# Altium schematic sheet MAGI'sPower.SchDoc
size A4
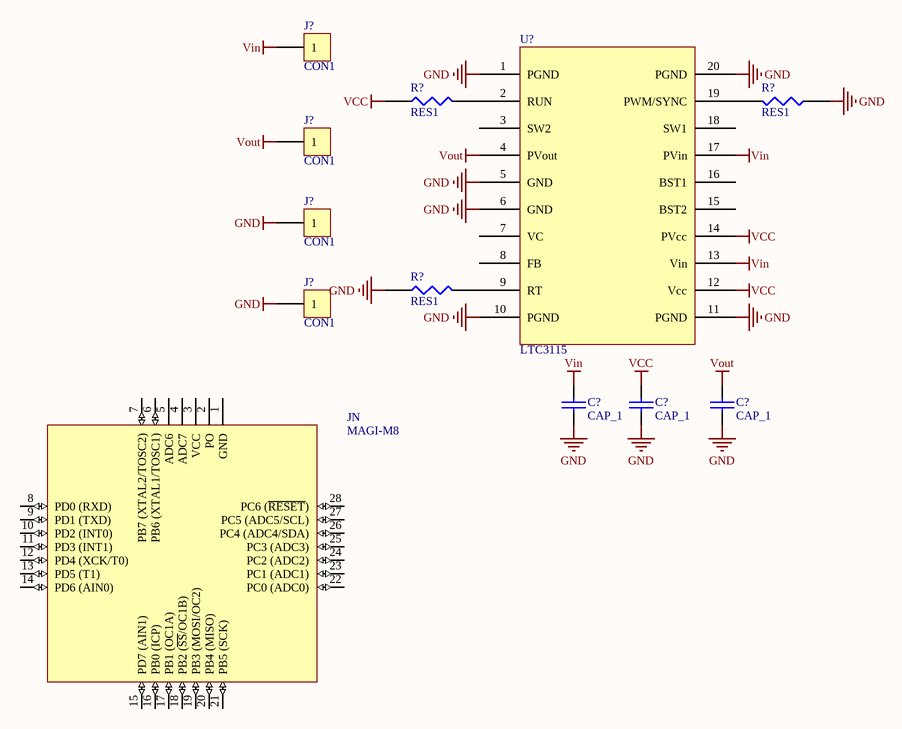
[diagram p0: MAGI'sPower.SchDoc]

## Parts
(Parts that share a designator on the sheet are numbered #1, #2 ... from top to bottom, then left to right.)
C?#1  CAP_1  [C100]
C?#2  CAP_1  [C100]
C?#3  CAP_1  [C100]
J?#1  CON1  [PCBConnect]
J?#2  CON1  [PCBConnect]
J?#3  CON1  [PCBConnect]
J?#4  CON1  [PCBConnect]
JN  MAGI-M8  [MAGI-M8]
R?#1  RES1  [0805]
R?#2  RES1  [0805]
R?#3  RES1  [0805]
U?  LTC3115  [LTC3115]

## Nets
GND: C?#1.2 C?#2.2 C?#3.2 J?#3.1 J?#4.1 R?#2.1 R?#3.1 U?.1(PGND) U?.5(GND) U?.6(GND) U?.10(PGND) U?.11(PGND) U?.20(PGND)
VCC: C?#2.1 R?#1.1 U?.12(Vcc) U?.14(PVcc)
Vin: C?#1.1 J?#1.1 U?.13(Vin) U?.17(PVin)
Vout: C?#3.1 J?#2.1 U?.4(PVout)
NetR?#1_2: R?#1.2 U?.2(RUN)
NetR?#2_2: R?#2.2 U?.19(PWM/SYNC)
NetR?#3_2: R?#3.2 U?.9(RT)

Not connected (* = marked no-connect by the designer): JN 1(GND) 2(PO) 3(VCC) 4(ADC7) 5(ADC6) 6(PB6_(XTAL1/TOSC1)) 7(PB7_(XTAL2/TOSC2)) 8(PD0_(RXD)) 9(PD1_(TXD)) 10(PD2_(INT0)) 11(PD3_(INT1)) 12(PD4_(XCK/T0)) 13(PD5_(T1)) 14(PD6_(AIN0)) 15(PD7_(AIN1)) 16(PB0_(ICP)) 17(PB1_(OC1A)) 18(PB2_(~{SS}/OC1B)) 19(PB3_(MOSI/OC2)) 20(PB4_(MISO)) 21(PB5_(SCK)) 22(PC0_(ADC0)) 23(PC1_(ADC1)) 24(PC2_(ADC2)) 25(PC3_(ADC3)) 26(PC4_(ADC4/SDA)) 27(PC5_(ADC5/SCL)) 28(PC6_(~{RESET})); U? 3(SW2) 7(VC) 8(FB) 15(BST2) 16(BST1) 18(SW1)

## Library data of the parts
C?#1-C?#3 = CAP_1: Capacitor
J?#1-J?#4 = CON1: Connector